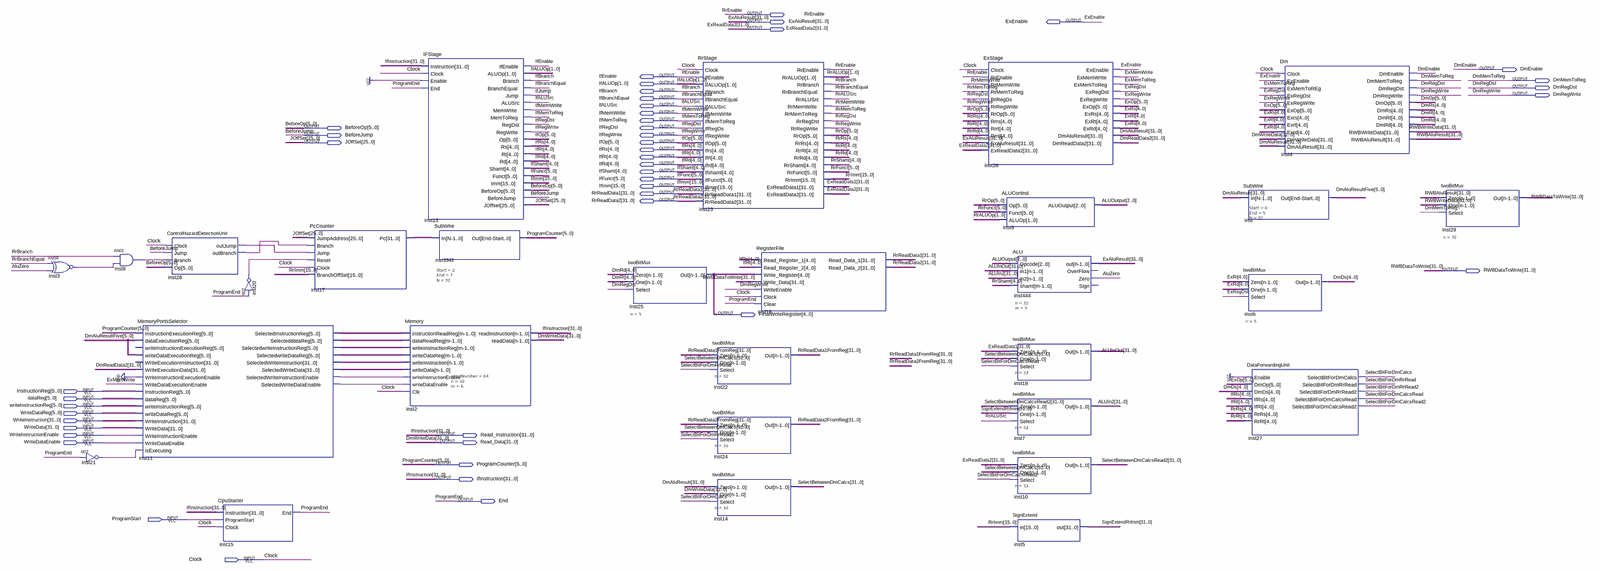
[diagram p0: schematic sheet, whole]
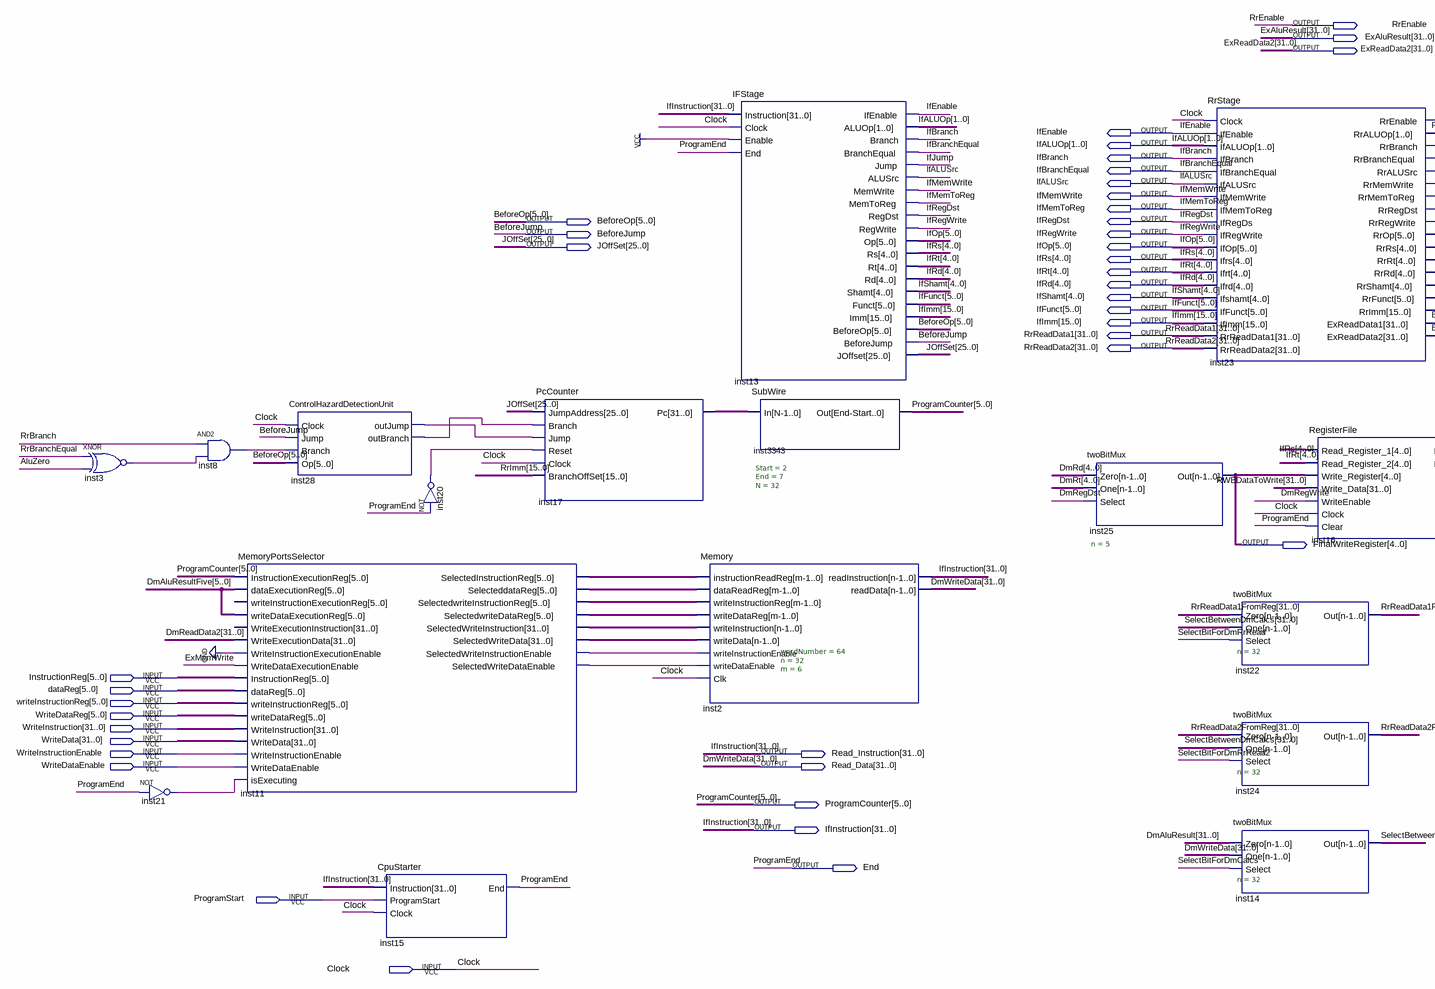
[diagram p1: schematic sheet, left part]
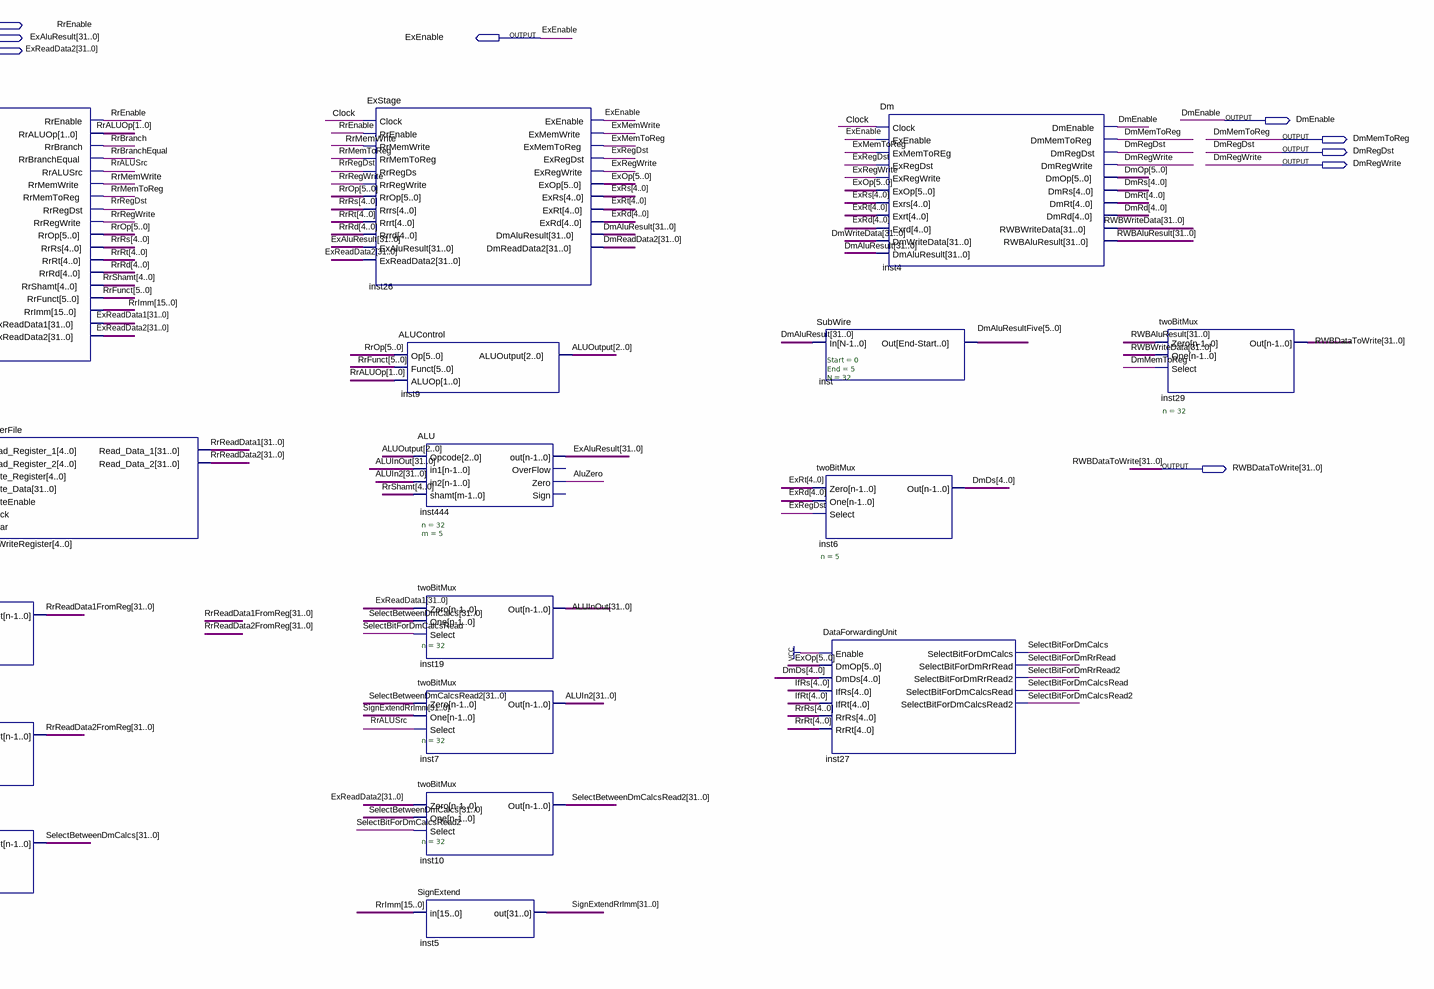
[diagram p2: schematic sheet, right part]
// Quartus schematic DataPath.bdf as structural Verilog: 29 symbols, 46 pins
module DataPath (
  input  [5:0] InstructionReg,
  input  [5:0] dataReg,
  input  [5:0] writeInstructionReg,
  input  [5:0] WriteDataReg,
  input  [31:0] WriteInstruction,
  input  [31:0] WriteData,
  input  WriteInstructionEnable,
  input  WriteDataEnable,
  input  ProgramStart,
  input  Clock,
  output RrEnable,
  output [31:0] ExAluResult,
  output ExEnable,
  output [31:0] ExReadData2,
  output DmEnable,
  output IfEnable,
  output DmMemToReg,
  output [1:0] IfALUOp,
  output DmRegDst,
  output IfBranch,
  output DmRegWrite,
  output IfBranchEqual,
  output IfALUSrc,
  output IfMemWrite,
  output IfMemToReg,
  output [5:0] BeforeOp,
  output IfRegDst,
  output BeforeJump,
  output IfRegWrite,
  output [25:0] JOffSet,
  output [5:0] IfOp,
  output [4:0] IfRs,
  output [4:0] IfRt,
  output [4:0] IfRd,
  output [4:0] IfShamt,
  output [5:0] IfFunct,
  output [15:0] IfImm,
  output [31:0] RrReadData1,
  output [31:0] RrReadData2,
  output [31:0] RWBDataToWrite,
  output [4:0] FinalWriteRegister,
  output [31:0] Read_Instruction,
  output [31:0] Read_Data,
  output [5:0] ProgramCounter,
  output [31:0] IfInstruction,
  output End
);

  wire AluZero, ExMemToReg, ExMemWrite, ExRegDst, ExRegWrite, IfJump, inst3_out, inst8_out,
       inst11_selectedwritedataenable, inst11_selectedwriteinstructionenable, inst20_out, inst21_out,
       inst28_outbranch, inst28_outjump, RrALUSrc, RrBranch, RrBranchEqual, RrMemToReg, RrMemWrite, RrRegDst,
       RrRegWrite, SelectBitForDmCalcs, SelectBitForDmCalcsRead, SelectBitForDmCalcsRead2,
       SelectBitForDmRrRead, SelectBitForDmRrRead2;
  wire [1:0] RrALUOp;
  wire [2:0] ALUOutput;
  wire [4:0] DmDs, DmRd, DmRs, DmRt, ExRd, ExRs, ExRt, RrRd, RrRs, RrRt, RrShamt;
  wire [5:0] DmAluResultFive, DmOp, ExOp, inst11_selecteddatareg, inst11_selectedinstructionreg,
       inst11_selectedwritedatareg, inst11_selectedwriteinstructionreg, RrFunct, RrOp;
  wire [15:0] RrImm;
  wire [31:0] ALUIn2, ALUInOut, DmAluResult, DmReadData2, ExReadData1, inst11_selectedwritedata,
       inst11_selectedwriteinstruction, inst17_pc, RrReadData1FromReg, RrReadData2FromReg, RWBAluResult,
       RWBWriteData, SelectBetweenDmCalcs, SelectBetweenDmCalcsRead2, SignExtendRrImm;

  xnor inst3 (inst3_out, RrBranchEqual, AluZero);
  not inst21 (inst21_out, End);
  and inst8 (inst8_out, RrBranch, inst3_out);
  MemoryPortsSelector inst11 (
    .InstructionExecutionReg(ProgramCounter), .dataExecutionReg(DmAluResultFive),
    .writeDataExecutionReg(DmAluResultFive), .WriteExecutionData(DmReadData2),
    .WriteInstructionExecutionEnable(1'b0), .WriteDataExecutionEnable(ExMemWrite),
    .InstructionReg(InstructionReg), .dataReg(dataReg), .writeInstructionReg(writeInstructionReg),
    .writeDataReg(WriteDataReg), .WriteInstruction(WriteInstruction), .WriteData(WriteData),
    .WriteInstructionEnable(WriteInstructionEnable), .WriteDataEnable(WriteDataEnable),
    .isExecuting(inst21_out), .SelectedInstructionReg(inst11_selectedinstructionreg),
    .SelecteddataReg(inst11_selecteddatareg),
    .SelectedwriteInstructionReg(inst11_selectedwriteinstructionreg),
    .SelectedwriteDataReg(inst11_selectedwritedatareg),
    .SelectedWriteInstruction(inst11_selectedwriteinstruction), .SelectedWriteData(inst11_selectedwritedata),
    .SelectedWriteInstructionEnable(inst11_selectedwriteinstructionenable),
    .SelectedWriteDataEnable(inst11_selectedwritedataenable));  // open: writeInstructionExecutionReg, WriteExecutionInstruction
  ControlHazardDetectionUnit inst28 (
    .Clock(Clock), .Jump(BeforeJump), .Branch(inst8_out), .Op(BeforeOp), .outJump(inst28_outjump),
    .outBranch(inst28_outbranch));
  CpuStarter inst15 (.Instruction(IfInstruction), .ProgramStart(ProgramStart), .Clock(Clock), .End(End));
  not inst20 (inst20_out, End);
  PcCounter inst17 (
    .JumpAddress(JOffSet), .Branch(inst28_outbranch), .Jump(inst28_outjump), .Reset(inst20_out),
    .Clock(Clock), .BranchOffSet(RrImm), .Pc(inst17_pc));
  Memory #(.wordNumber(64), .n(32), .m(6)) inst2 (
    .instructionReadReg(inst11_selectedinstructionreg), .dataReadReg(inst11_selecteddatareg),
    .writeInstructionReg(inst11_selectedwriteinstructionreg), .writeDataReg(inst11_selectedwritedatareg),
    .writeInstruction(inst11_selectedwriteinstruction), .writeData(inst11_selectedwritedata),
    .writeInstructionEnable(inst11_selectedwriteinstructionenable),
    .writeDataEnable(inst11_selectedwritedataenable), .Clk(Clock), .readInstruction(IfInstruction),
    .readData(Read_Data));
  IFStage inst13 (
    .Instruction(IfInstruction), .Clock(Clock), .Enable(1'b1), .End(End), .IfEnable(IfEnable),
    .ALUOp(IfALUOp), .Branch(IfBranch), .BranchEqual(IfBranchEqual), .Jump(IfJump), .ALUSrc(IfALUSrc),
    .MemWrite(IfMemWrite), .MemToReg(IfMemToReg), .RegDst(IfRegDst), .RegWrite(IfRegWrite), .Op(IfOp),
    .Rs(IfRs), .Rt(IfRt), .Rd(IfRd), .Shamt(IfShamt), .Funct(IfFunct), .Imm(IfImm), .BeforeOp(BeforeOp),
    .BeforeJump(BeforeJump), .JOffset(JOffSet));
  SubWire #(.Start(2), .End(7), .N(32)) inst3343 (.In(inst17_pc), .Out(ProgramCounter));
  twoBitMux #(.n(5)) inst25 (.Zero(DmRd), .One(DmRt), .Select(DmRegDst), .Out(FinalWriteRegister));
  RrStage inst23 (
    .Clock(Clock), .IfEnable(IfEnable), .IfALUOp(IfALUOp), .IfBranch(IfBranch),
    .IfBranchEqual(IfBranchEqual), .IfALUSrc(IfALUSrc), .IfMemWrite(IfMemWrite), .IfMemToReg(IfMemToReg),
    .IfRegDs(IfRegDst), .IfRegWrite(IfRegWrite), .IfOp(IfOp), .Ifrs(IfRs), .Ifrt(IfRt), .Ifrd(IfRd),
    .Ifshamt(IfShamt), .IfFunct(IfFunct), .IfImm(IfImm), .RrReadData1(RrReadData1),
    .RrReadData2(RrReadData2), .RrEnable(RrEnable), .RrALUOp(RrALUOp), .RrBranch(RrBranch),
    .RrBranchEqual(RrBranchEqual), .RrALUSrc(RrALUSrc), .RrMemWrite(RrMemWrite), .RrMemToReg(RrMemToReg),
    .RrRegDst(RrRegDst), .RrRegWrite(RrRegWrite), .RrOp(RrOp), .RrRs(RrRs), .RrRt(RrRt), .RrRd(RrRd),
    .RrShamt(RrShamt), .RrFunct(RrFunct), .RrImm(RrImm), .ExReadData1(ExReadData1), .ExReadData2(ExReadData2));
  twoBitMux #(.n(32)) inst22 (
    .Zero(RrReadData1FromReg), .One(SelectBetweenDmCalcs), .Select(SelectBitForDmRrRead),
    .Out(RrReadData1FromReg));
  twoBitMux #(.n(32)) inst24 (
    .Zero(RrReadData2FromReg), .One(SelectBetweenDmCalcs), .Select(SelectBitForDmRrRead2),
    .Out(RrReadData2FromReg));
  twoBitMux #(.n(32)) inst14 (
    .Zero(DmAluResult), .One(Read_Data), .Select(SelectBitForDmCalcs), .Out(SelectBetweenDmCalcs));
  RegisterFile inst16 (
    .Read_Register_1(IfRs), .Read_Register_2(IfRt), .Write_Register(FinalWriteRegister),
    .Write_Data(RWBDataToWrite), .WriteEnable(DmRegWrite), .Clock(Clock), .Clear(End),
    .Read_Data_1(RrReadData1), .Read_Data_2(RrReadData2));
  ExStage inst26 (
    .Clock(Clock), .RrEnable(RrEnable), .RrMemWrite(RrMemWrite), .RrMemToReg(RrMemToReg), .RrRegDs(RrRegDst),
    .RrRegWrite(RrRegWrite), .RrOp(RrOp), .Rrrs(RrRs), .Rrrt(RrRt), .Rrrd(RrRd), .ExAluResult(ExAluResult),
    .ExReadData2(ExReadData2), .ExEnable(ExEnable), .ExMemWrite(ExMemWrite), .ExMemToReg(ExMemToReg),
    .ExRegDst(ExRegDst), .ExRegWrite(ExRegWrite), .ExOp(ExOp), .ExRs(ExRs), .ExRt(ExRt), .ExRd(ExRd),
    .DmAluResult(DmAluResult), .DmReadData2(DmReadData2));
  ALUControl inst9 (.Op(RrOp), .Funct(RrFunct), .ALUOp(RrALUOp), .ALUOutput(ALUOutput));
  ALU #(.n(32), .m(5)) inst444 (
    .Opcode(ALUOutput), .in1(ALUInOut), .in2(ALUIn2), .shamt(RrShamt), .out(ExAluResult), .Zero(AluZero));  // open: OverFlow, Sign
  twoBitMux #(.n(32)) inst19 (
    .Zero(ExReadData1), .One(SelectBetweenDmCalcs), .Select(SelectBitForDmCalcsRead), .Out(ALUInOut));
  twoBitMux #(.n(32)) inst7 (.Zero(SelectBetweenDmCalcsRead2), .One(SignExtendRrImm), .Select(RrALUSrc), .Out(ALUIn2));
  twoBitMux #(.n(32)) inst10 (
    .Zero(ExReadData2), .One(SelectBetweenDmCalcs), .Select(SelectBitForDmCalcsRead2),
    .Out(SelectBetweenDmCalcsRead2));
  SignExtend inst5 (.in(RrImm), .out(SignExtendRrImm));
  SubWire #(.Start(0), .End(5), .N(32)) inst (.In(DmAluResult), .Out(DmAluResultFive));
  twoBitMux #(.n(5)) inst6 (.Zero(ExRt), .One(ExRd), .Select(ExRegDst), .Out(DmDs));
  DataForwardingUnit inst27 (
    .Enable(1'b1), .DmOp(ExOp), .DmDs(DmDs), .IfRs(IfRs), .IfRt(IfRt), .RrRs(RrRs), .RrRt(RrRt),
    .SelectBitForDmCalcs(SelectBitForDmCalcs), .SelectBitForDmRrRead(SelectBitForDmRrRead),
    .SelectBitForDmRrRead2(SelectBitForDmRrRead2), .SelectBitForDmCalcsRead(SelectBitForDmCalcsRead),
    .SelectBitForDmCalcsRead2(SelectBitForDmCalcsRead2));
  Dm inst4 (
    .Clock(Clock), .ExEnable(ExEnable), .ExMemToREg(ExMemToReg), .ExRegDst(ExRegDst),
    .ExRegWrite(ExRegWrite), .ExOp(ExOp), .Exrs(ExRs), .Exrt(ExRt), .Exrd(ExRd), .DmWriteData(Read_Data),
    .DmAluResult(DmAluResult), .DmEnable(DmEnable), .DmMemToReg(DmMemToReg), .DmRegDst(DmRegDst),
    .DmRegWrite(DmRegWrite), .DmOp(DmOp), .DmRs(DmRs), .DmRt(DmRt), .DmRd(DmRd), .RWBWriteData(RWBWriteData),
    .RWBAluResult(RWBAluResult));
  twoBitMux #(.n(32)) inst29 (.Zero(RWBAluResult), .One(RWBWriteData), .Select(DmMemToReg), .Out(RWBDataToWrite));

  assign Read_Instruction = IfInstruction;

  // Other names for the same wires on the sheet: DmWriteData[31:0] = Read_Data; ProgramEnd = End
endmodule
